# EAGLE design 16ChFNIRS (EAGLE 9.6.2)
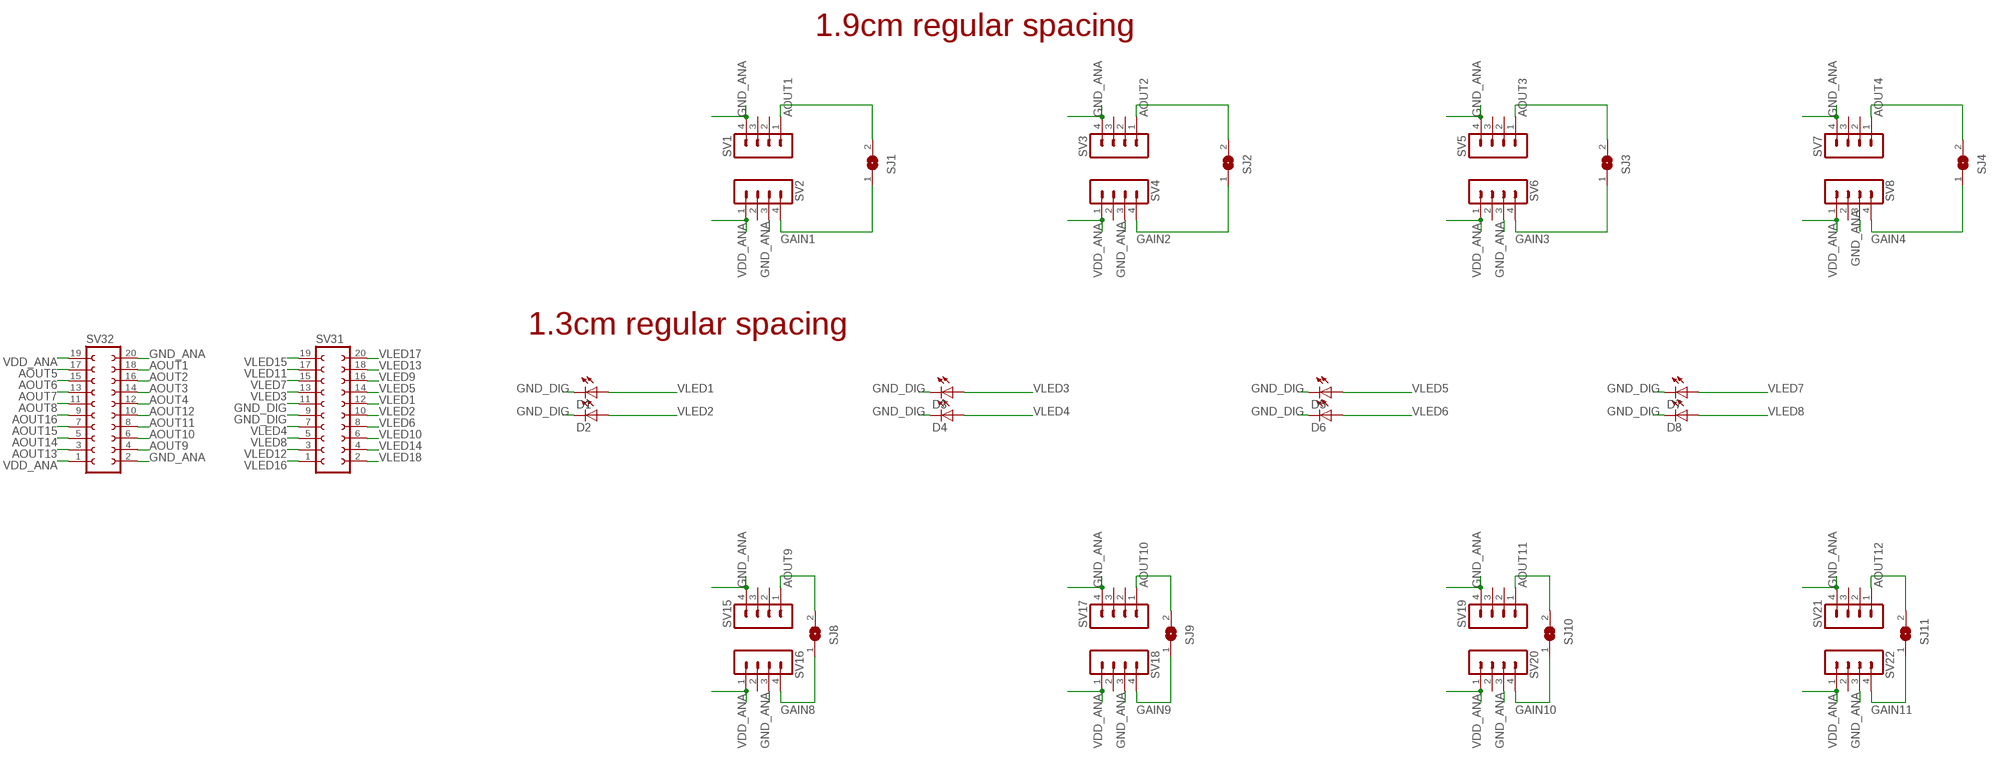
[diagram p0: schematic, sheet 1, part 1 of 2]
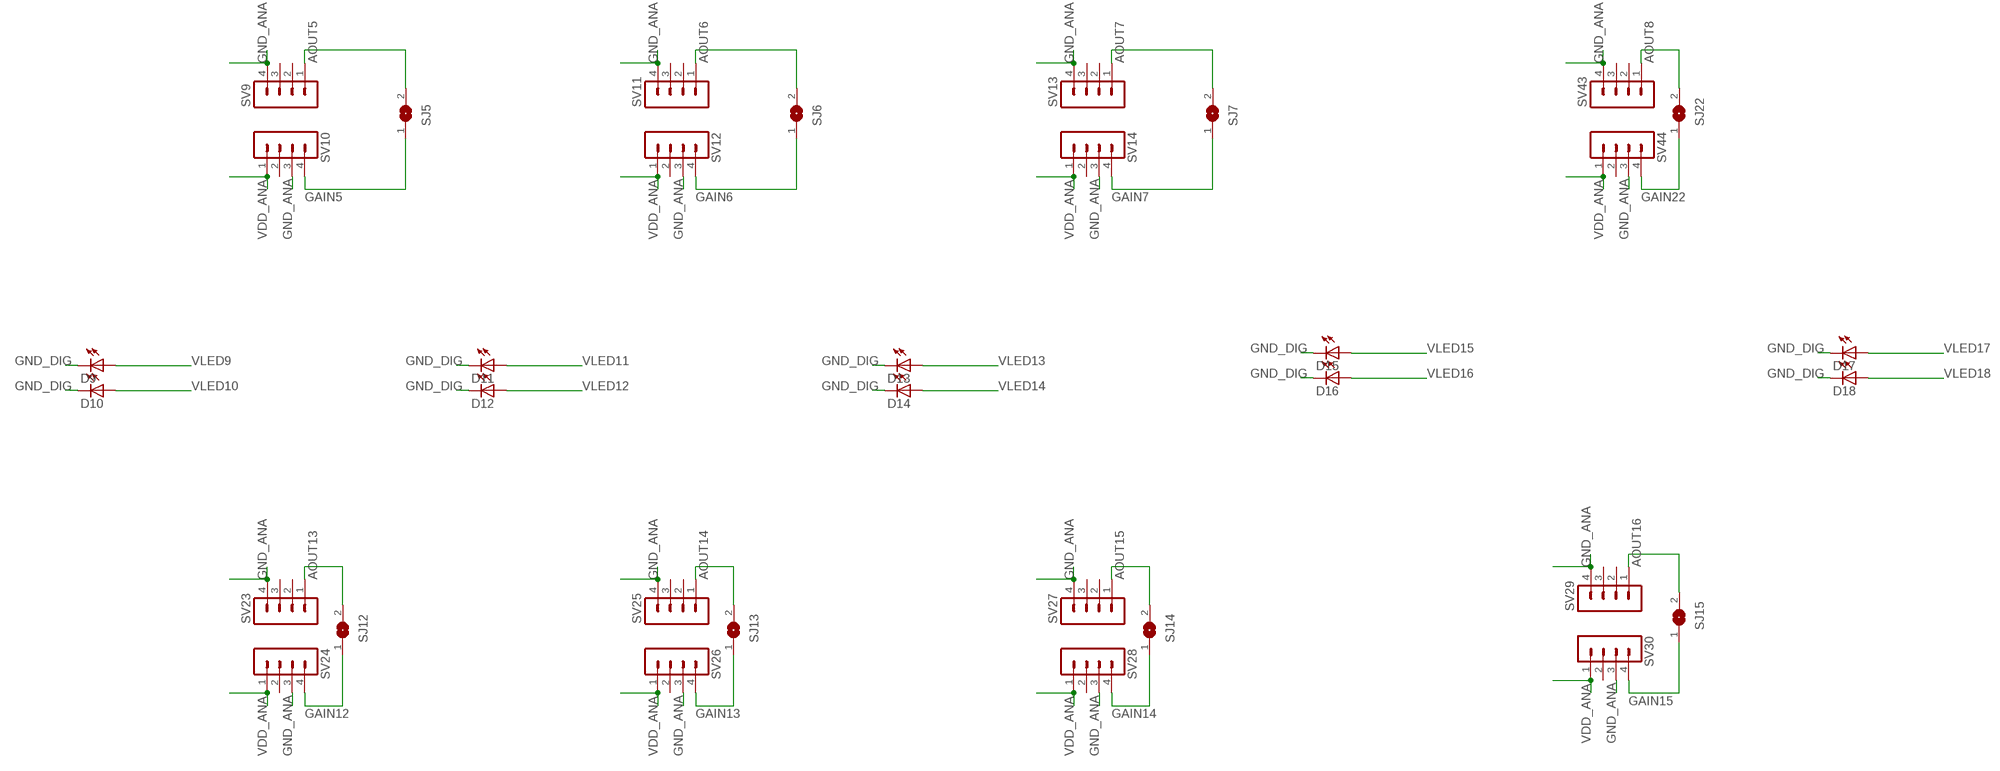
[diagram p1: schematic, sheet 1, part 2 of 2]

## Parts
D1  LED1206  [LED-1206]
D2  LED1206  [LED-1206]
D3  LED1206  [LED-1206]
D4  LED1206  [LED-1206]
D5  LED1206  [LED-1206]
D6  LED1206  [LED-1206]
D7  LED1206  [LED-1206]
D8  LED1206  [LED-1206]
D9  LED1206  [LED-1206]
D10  LED1206  [LED-1206]
D11  LED1206  [LED-1206]
D12  LED1206  [LED-1206]
D13  LED1206  [LED-1206]
D14  LED1206  [LED-1206]
D15  LED1206  [LED-1206]
D16  LED1206  [LED-1206]
D17  LED1206  [LED-1206]
D18  LED1206  [LED-1206]
SJ1  SJ  [SJ]
SJ2  SJ  [SJ]
SJ3  SJ  [SJ]
SJ4  SJ  [SJ]
SJ5  SJ  [SJ]
SJ6  SJ  [SJ]
SJ7  SJ  [SJ]
SJ8  SJ  [SJ]
SJ9  SJ  [SJ]
SJ10  SJ  [SJ]
SJ11  SJ  [SJ]
SJ12  SJ  [SJ]
SJ13  SJ  [SJ]
SJ14  SJ  [SJ]
SJ15  SJ  [SJ]
SJ22  SJ  [SJ]
SV1  MA04-1  [MA04-1]
SV2  MA04-1  [MA04-1]
SV3  MA04-1  [MA04-1]
SV4  MA04-1  [MA04-1]
SV5  MA04-1  [MA04-1]
SV6  MA04-1  [MA04-1]
SV7  MA04-1  [MA04-1]
SV8  MA04-1  [MA04-1]
SV9  MA04-1  [MA04-1]
SV10  MA04-1  [MA04-1]
SV11  MA04-1  [MA04-1]
SV12  MA04-1  [MA04-1]
SV13  MA04-1  [MA04-1]
SV14  MA04-1  [MA04-1]
SV15  MA04-1  [MA04-1]
SV16  MA04-1  [MA04-1]
SV17  MA04-1  [MA04-1]
SV18  MA04-1  [MA04-1]
SV19  MA04-1  [MA04-1]
SV20  MA04-1  [MA04-1]
SV21  MA04-1  [MA04-1]
SV22  MA04-1  [MA04-1]
SV23  MA04-1  [MA04-1]
SV24  MA04-1  [MA04-1]
SV25  MA04-1  [MA04-1]
SV26  MA04-1  [MA04-1]
SV27  MA04-1  [MA04-1]
SV28  MA04-1  [MA04-1]
SV29  MA04-1  [MA04-1]
SV30  MA04-1  [MA04-1]
SV31  FE10-2  [FE10-2]
SV32  FE10-2  [FE10-2]
SV43  MA04-1  [MA04-1]
SV44  MA04-1  [MA04-1]

## Nets
AOUT1: SJ1.2 SV1.1 SV32.18
AOUT2: SJ2.2 SV3.1 SV32.16
AOUT3: SJ3.2 SV5.1 SV32.14
AOUT4: SJ4.2 SV7.1 SV32.12
AOUT5: SJ5.2 SV9.1 SV32.17
AOUT6: SJ6.2 SV11.1 SV32.15
AOUT7: SJ7.2 SV13.1 SV32.13
AOUT8: SJ22.2 SV32.11 SV43.1
AOUT9: SJ8.2 SV15.1 SV32.4
AOUT10: SJ9.2 SV17.1 SV32.6
AOUT11: SJ10.2 SV19.1 SV32.8
AOUT12: SJ11.2 SV21.1 SV32.10
AOUT13: SJ12.2 SV23.1 SV32.3
AOUT14: SJ13.2 SV25.1 SV32.5
AOUT15: SJ14.2 SV27.1 SV32.7
AOUT16: SJ15.2 SV29.1 SV32.9
GAIN1: SJ1.1 SV2.4
GAIN2: SJ2.1 SV4.4
GAIN3: SJ3.1 SV6.4
GAIN4: SJ4.1 SV8.4
GAIN5: SJ5.1 SV10.4
GAIN6: SJ6.1 SV12.4
GAIN7: SJ7.1 SV14.4
GAIN8: SJ8.1 SV16.4
GAIN9: SJ9.1 SV18.4
GAIN10: SJ10.1 SV20.4
GAIN11: SJ11.1 SV22.4
GAIN12: SJ12.1 SV24.4
GAIN13: SJ13.1 SV26.4
GAIN14: SJ14.1 SV28.4
GAIN15: SJ15.1 SV30.4
GAIN22: SJ22.1 SV44.4
GND_ANA: SV1.4 SV2.3 SV3.4 SV4.3 SV5.4 SV6.3 SV7.4 SV8.3 SV9.4 SV10.3 SV11.4 SV12.3 SV13.4 SV14.3 SV15.4 SV16.3 SV17.4 SV18.3 SV19.4 SV20.3 SV21.4 SV22.3 SV23.4 SV24.3 SV25.4 SV26.3 SV27.4 SV28.3 SV29.4 SV30.3 SV32.2 SV32.20 SV43.4 SV44.3
GND_DIG: D1.C D2.C D3.C D4.C D5.C D6.C D7.C D8.C D9.C D10.C D11.C D12.C D13.C D14.C D15.C D16.C D17.C D18.C SV31.9 SV31.11
VDD_ANA: SV2.1 SV4.1 SV6.1 SV8.1 SV10.1 SV12.1 SV14.1 SV16.1 SV18.1 SV20.1 SV22.1 SV24.1 SV26.1 SV28.1 SV30.1 SV32.1 SV32.19 SV44.1
VLED1: D1.A SV31.12
VLED2: D2.A SV31.10
VLED3: D3.A SV31.13
VLED4: D4.A SV31.7
VLED5: D5.A SV31.14
VLED6: D6.A SV31.8
VLED7: D7.A SV31.15
VLED8: D8.A SV31.5
VLED9: D9.A SV31.16
VLED10: D10.A SV31.6
VLED11: D11.A SV31.17
VLED12: D12.A SV31.3
VLED13: D13.A SV31.18
VLED14: D14.A SV31.4
VLED15: D15.A SV31.19
VLED16: D16.A SV31.1
VLED17: D17.A SV31.20
VLED18: D18.A SV31.2
Unconnected: SV1.2 SV1.3 SV2.2 SV3.2 SV3.3 SV4.2 SV5.2 SV5.3 SV6.2 SV7.2 SV7.3 SV8.2 SV9.2 SV9.3 SV10.2 SV11.2 SV11.3 SV12.2 SV13.2 SV13.3 SV14.2 SV15.2 SV15.3 SV16.2 SV17.2 SV17.3 SV18.2 SV19.2 SV19.3 SV20.2 SV21.2 SV21.3 SV22.2 SV23.2 SV23.3 SV24.2 SV25.2 SV25.3 SV26.2 SV27.2 SV27.3 SV28.2 SV29.2 SV29.3 SV30.2 SV43.2 SV43.3 SV44.2

## Notes on the sheet
- 1.9cm regular spacing
- 1.3cm regular spacing

## Library data of the parts
D1-D18 = epic:LED: LEDs Standard schematic elements and footprints for 5mm, 3mm, 1206, and 0603 sized LEDs. 5mm - Spark Fun Electronics SKU : COM-00529 (and others)
SJ1-SJ15 SJ22 = jumper:SJ: SMD solder JUMPER
SV1-SV30 SV43 SV44 = con-lstb:MA04-1: PIN HEADER; OC_FARNELL: unknown; OC_NEWARK: unknown
SV31 SV32 = con-lsta:FE10-2: FEMALE HEADER; OC_FARNELL: unknown; OC_NEWARK: unknown

## Board
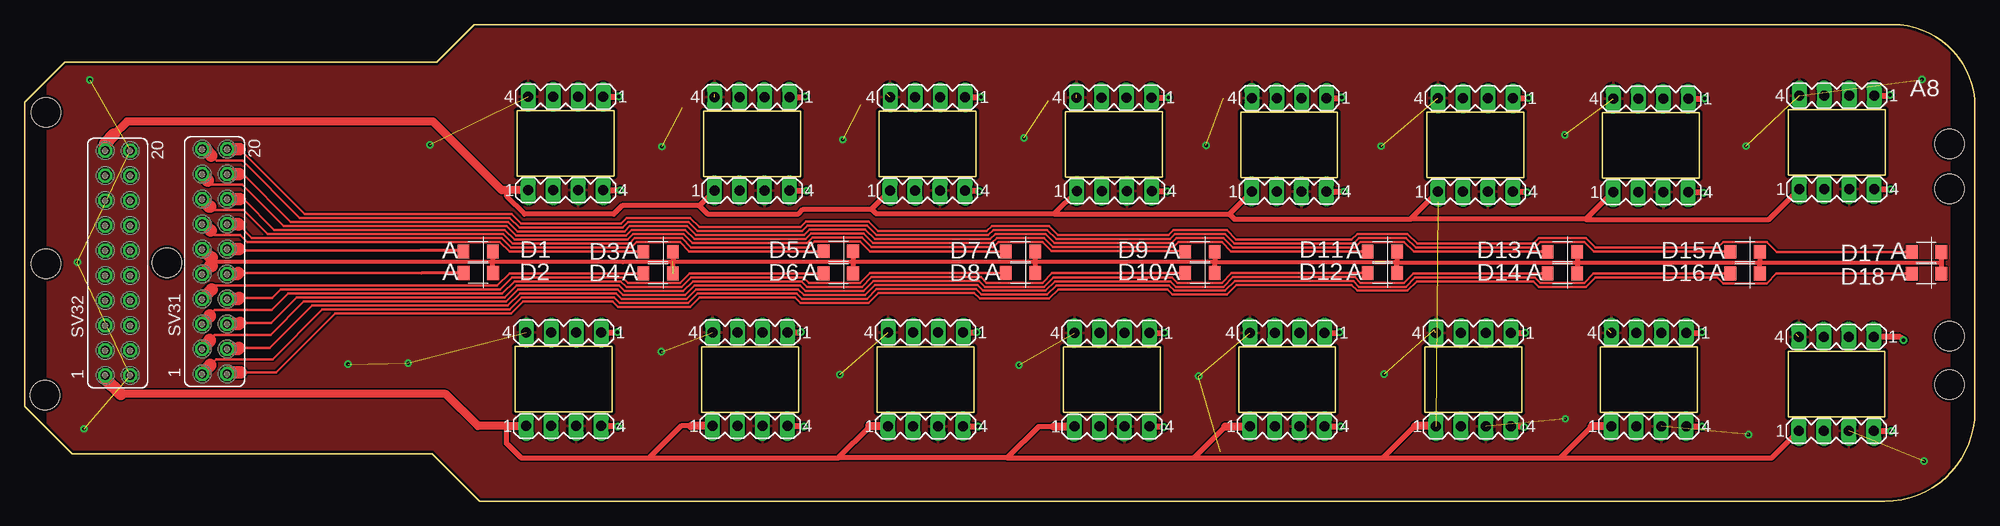
[diagram p2: board, top side]
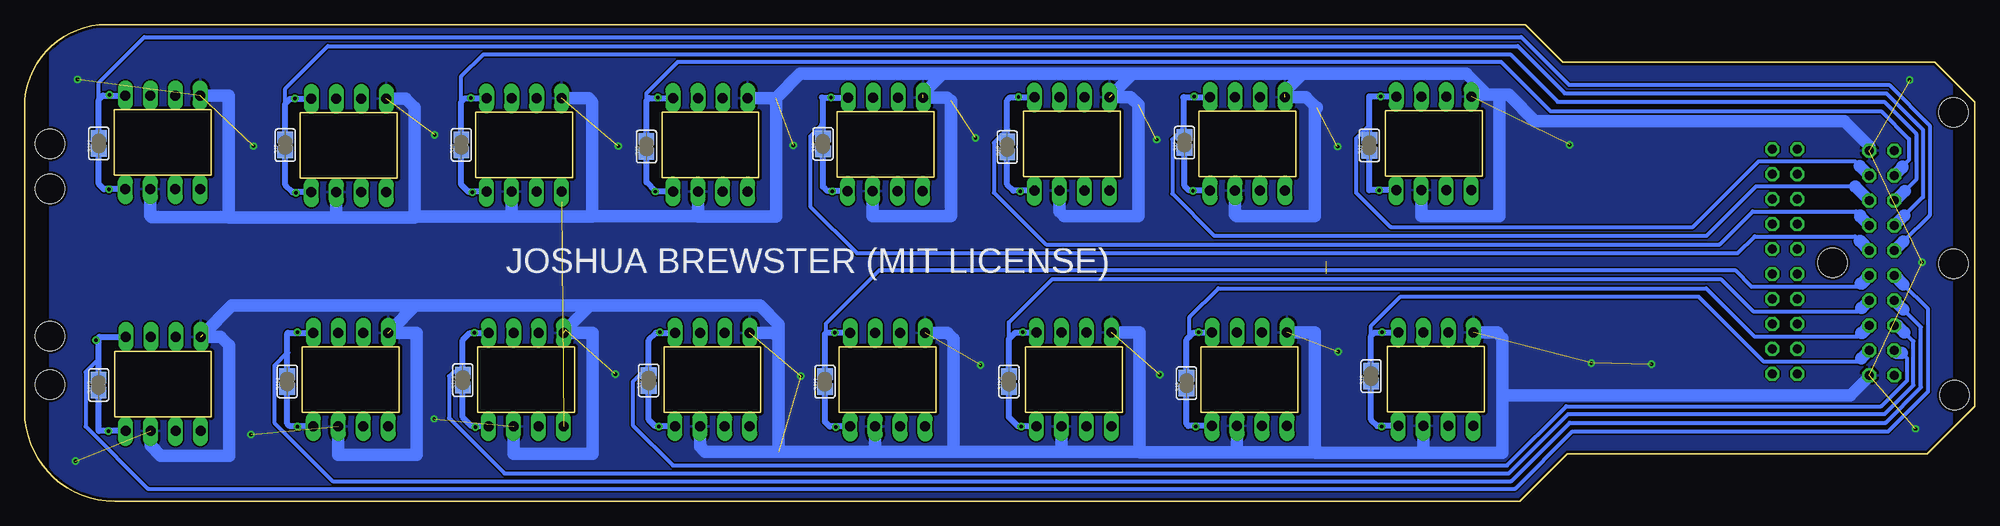
[diagram p3: board, bottom side, seen from below]

Size 198.37 x 48.51 mm. Coordinates in mm from the lower left corner, seen from the top.
Outline: 78.91,33.05 69.07,33.05 69.07,39.71 78.91,39.71 78.91,33.05
Outline: 59.96,33.07 50.12,33.07 50.12,39.74 59.96,39.74 59.96,33.07
Outline: 115.72,32.99 105.87,32.99 105.87,39.66 115.72,39.66 115.72,32.99
Outline: 96.77,33.02 86.93,33.02 86.93,39.69 96.77,39.69 96.77,33.02
Outline: 152.5,32.92 142.65,32.92 142.65,39.59 152.5,39.59 152.5,32.92
Outline: 133.55,32.94 123.7,32.94 123.7,39.61 133.55,39.61 133.55,32.94
Outline: 170.33,32.87 160.48,32.87 160.48,39.53 170.33,39.53 170.33,32.87
Outline: 49.92,15.75 59.76,15.75 59.76,9.08 49.92,9.08 49.92,15.75
Outline: 68.87,15.72 78.71,15.72 78.71,9.05 68.87,9.05 68.87,15.72
Outline: 86.72,15.72 96.56,15.72 96.56,9.05 86.72,9.05 86.72,15.72
Outline: 105.67,15.7 115.51,15.7 115.51,9.03 105.67,9.03 105.67,15.7
Outline: 123.5,15.72 133.34,15.72 133.34,9.05 123.5,9.05 123.5,15.72
Outline: 142.45,15.7 152.29,15.7 152.29,9.03 142.45,9.03 142.45,15.7
Outline: 160.28,15.72 170.12,15.72 170.12,9.05 160.28,9.05 160.28,15.72
Outline: 189.21,8.58 179.37,8.58 179.37,15.25 189.21,15.25 189.21,8.58
Outline: 179.4,39.87 189.24,39.87 189.24,33.2 179.4,33.2 179.4,39.87
Outline: 41.91,44.7 4.06,44.7 0,40.64 0,9.65 4.83,4.83 41.45,4.83 46.28,0 189.23,0 arc90 198.37,9.14 198.37,40.13 arc90 189.99,48.51 45.72,48.51 41.91,44.7
Copper layers (1*16): Top 0.035mm / dielectric 1.5mm / Bottom 0.035mm
Design rules "default *": minimum track width 6mil, minimum drill 0.35mm, track to track 6mil, track to pad 6mil, pad to pad 6mil, via to via 6mil, smd to smd 6mil, copper to edge 10mil, drill to drill 6mil, minimum pad ring 10mil, minimum via ring 8mil, stop-mask expansion 4mil, vias tented up to drill 0mil, thermal gap 10mil
Holes 3 mm at 2.17,39.58 14.47,24.28 2.17,24.18 2.07,10.78 195.77,36.38 195.77,31.78 195.77,16.78 195.77,11.88

### Footprints (pad centres in the part's own frame; a part is rotated, then mirrored left to right if it is on the bottom)
LED-1206 = smd 1.2 x 1.4: A -1.5,0; C 1.5,0
SJ = smd 1.168 x 1.6: 1 -0.762,0; 2 0.762,0
MA04-1 = drill 1.016 long: 1 -3.81,0; 2 -1.27,0; 3 1.27,0; 4 3.81,0
FE10-2 = drill 0.914 octagon: 1 -11.43,1.27; 2 -11.43,-1.27; 3 -8.89,1.27; 4 -8.89,-1.27; 5 -6.35,1.27; 6 -6.35,-1.27; 7 -3.81,1.27; 8 -3.81,-1.27; 9 -1.27,1.27; 10 -1.27,-1.27; 11 1.27,1.27; 12 1.27,-1.27; 13 3.81,1.27; 14 3.81,-1.27; 15 6.35,1.27; 16 6.35,-1.27; 17 8.89,1.27; 18 8.89,-1.27; 19 11.43,1.27; 20 11.43,-1.27

### Placement (x,y rotation side)
D1  46.13,25.43 0 top
D2  46.15,23.22 0 top
D3  64.44,25.4 0 top
D4  64.44,23.19 0 top
D5  82.78,25.45 0 top
D6  82.78,23.19 0 top
D7  101.3,25.43 0 top
D8  101.3,23.22 0 top
D9  119.56,25.4 0 top
D10  119.56,23.22 0 top
D11  138.1,25.43 0 top
D12  138.1,23.22 0 top
D13  156.41,25.4 0 top
D14  156.41,23.19 0 top
D15  174.98,25.4 0 top
D16  174.98,23.16 0 top
D17  193.44,25.37 0 top
D18  193.44,23.16 0 top
SJ1  61.59,36.22 90 bottom
SJ2  80.39,36.5 90 bottom
SJ3  98.42,36.04 90 bottom
SJ4  117.17,36.37 90 bottom
SJ5  135.13,36.09 90 bottom
SJ6  153.95,36.27 90 bottom
SJ7  171.86,36.25 90 bottom
SJ8  61.42,12.73 90 bottom
SJ9  80.19,12.01 90 bottom
SJ10  98.25,12.19 90 bottom
SJ11  116.97,12.17 90 bottom
SJ12  134.9,12.29 90 bottom
SJ13  153.8,12.32 90 bottom
SJ14  171.65,12.19 90 bottom
SJ15  190.85,11.83 90 bottom
SJ22  190.83,36.41 90 bottom
SV1  55.04,41.17 180 top
SV2  55.04,31.65 0 top
SV3  73.99,41.15 180 top
SV4  73.99,31.62 0 top
SV5  91.85,41.12 180 top
SV6  91.85,31.6 0 top
SV7  110.79,41.1 180 top
SV8  110.85,31.57 0 top
SV9  128.63,41.05 180 top
SV10  128.63,31.52 0 top
SV11  147.57,41.02 180 top
SV12  147.57,31.5 0 top
SV13  165.4,40.97 180 top
SV14  165.4,31.45 0 top
SV15  54.84,17.17 180 top
SV16  54.84,7.65 0 top
SV17  73.79,17.17 180 top
SV18  73.79,7.65 0 top
SV19  91.64,17.17 180 top
SV20  91.64,7.62 0 top
SV21  110.59,17.12 180 top
SV22  110.59,7.59 0 top
SV23  128.42,17.14 180 top
SV24  128.42,7.62 0 top
SV25  147.37,17.12 180 top
SV26  147.37,7.62 0 top
SV27  165.2,17.14 180 top
SV28  165.2,7.62 0 top
SV29  184.27,16.74 180 top
SV30  184.29,7.16 0 top
SV31  19.32,24.39 90 top
SV32  9.46,24.24 90 top
SV43  184.32,41.29 180 top
SV44  184.32,31.77 0 top

### Tracks (layer width: path | path; a pad name or v marks a point on that pad's centre or on a via)
AOUT1  (via drill 0.35)
  Top 0.61: SV1.1 60.43,41.17 v60.43,41.21
  Bottom 0.406: 61.59,38.26 62.95,36.91 62.95,31.41 59.44,27.91 28.68,27.91 21.99,34.59 12.21,34.59 11.73,34.12
  Bottom 0.61: SJ1.2 61.59,38.26 61.59,41.18 61.6,41.17 SV1.1
  Bottom 1.27: SV32.18 11.72,34.12 11.73,34.12
AOUT2  (via drill 0.35)
  Top 0.61: SV3.1 79.4,41.15 v79.4,41.18
  Bottom 0.406: 80.52,37.94 81.65,36.81 81.65,31.3 77.38,27.03 27.29,27.03 22.27,32.05 12.19,32.05
  Bottom 0.61: SJ2.2 80.52,37.03 80.52,37.94 80.52,41.12 80.49,41.15 SV3.1
  Bottom 1.27: SV32.16 12.19,32.04 12.19,32.05
AOUT3  (via drill 0.35)
  Top 0.61: SV5.1 97.28,41.12 v97.28,41.16
  Bottom 0.406: 98.42,37.83 99.77,36.48 99.77,31.4 94.51,26.13 25.97,26.13 22.6,29.5 12.08,29.5 11.64,29.06
  Bottom 0.61: SJ3.2 98.42,37.83 98.42,40.82 98.12,41.12 SV5.1
  Bottom 1.27: SV32.14 11.64,28.95 11.64,29.06
AOUT4  (via drill 0.35)
  Top 0.61: SV7.1 116.35,41.1 v116.35,41.11
  Bottom 0.406: 117.22,38.37 118.46,37.13 118.46,29.99 113.7,25.24 24.12,25.24 22.4,26.96 12.2,26.96 11.7,26.46
  Bottom 0.61: SJ4.2 117.22,36.82 117.22,38.37 117.22,41.12 117.25,41.1 | 117.27,41.1 117.25,41.1 | 117.25,41.1 SV7.1
  Bottom 1.27: SV32.12 11.68,26.46 11.7,26.46
AOUT5  (via drill 0.35)
  Top 0.61: SV9.1 133.99,41.05 v133.99,41.08
  Bottom 0.406: 135.13,40.77 135.13,41.53 131.93,44.73 48.19,44.73 43.16,39.7 9.55,39.7 6.7,36.85 6.7,34.73 7.37,34.06
  Bottom 0.61: SJ5.2 135.13,40.77 134.85,41.05 SV9.1
  Bottom 1.27: SV32.17 7.37,33.95 7.37,34.06
AOUT6  (via drill 0.35)
  Top 0.61: SV11.1 152.98,41.02 v152.98,41.06
  Bottom 0.406: 153.95,40.66 153.95,43.24 151.71,45.48 47.25,45.48 42.43,40.66 9.22,40.66 5.97,37.4 5.97,32.72 7.13,31.55
  Bottom 0.61: SJ6.2 153.95,40.66 153.59,41.02 SV11.1
  Bottom 1.27: 7.13,31.55 8.1,30.59 SV32.15
AOUT7  (via drill 0.35)
  Top 0.61: SV13.1 170.89,40.97 v170.89,41
  Bottom 0.406: 171.86,40.49 171.86,41.99 167.53,46.32 46.51,46.32 41.71,41.53 9.01,41.53 5.29,37.82 5.29,30.95 7.19,29.06
  Bottom 0.61: SJ7.2 171.86,40.49 171.37,40.97 SV13.1
  Bottom 1.27: 7.19,29.06 8.19,28.05 SV32.13
AOUT8  (via drill 0.35)
  Top 0.61: SV43.1 189.73,41.29 v189.73,41.34
  Bottom 0.406: 190.82,40.88 190.82,42.61 186.19,47.25 46.15,47.25 41.29,42.38 8.73,42.38 4.6,38.25 4.6,29.09 7.27,26.42
  Bottom 0.61: SJ22.2 190.82,40.88 190.42,41.29 SV43.1
  Bottom 1.27: 7.27,26.42 SV32.11
AOUT9  (via drill 0.35)
  Top 0.61: SV15.1 60.27,17.17 v60.27,17.22
  Bottom 0.406: 61.42,16.84 61.42,17.85 58.44,20.83 28.11,20.83 21.53,14.25 11.87,14.25 11.58,14.54
  Bottom 0.61: SJ8.2 61.42,16.84 61.09,17.17 SV15.1
  Bottom 1.27: SV32.4 11.54,14.54 11.58,14.54
AOUT10  (via drill 0.35)
  Top 0.61: SV17.1 78.94,17.17 v78.94,17.19
  Bottom 0.406: 79.88,16.77 79.88,18.75 76.96,21.67 27.33,21.67 22.45,16.79 11.91,16.79 11.56,17.14
  Bottom 0.61: SJ9.2 80.19,16.46 79.88,16.77 79.48,17.17 SV17.1
  Bottom 1.27: SV32.6 11.48,17.14 11.56,17.14
AOUT11  (via drill 0.35)
  Top 0.61: SV19.1 96.85,17.17 v96.85,17.19
  Bottom 0.406: 98.25,16.51 98.25,18.2 93.83,22.62 25.85,22.62 22.55,19.32 11.9,19.32 11.54,19.67
  Bottom 0.61: SJ10.2 98.25,16.51 97.59,17.17 SV19.1
  Bottom 1.27: SV32.8 11.48,19.67 11.54,19.67
AOUT12  (via drill 0.35)
  Top 0.61: SV21.1 115.95,17.12 v115.95,17.17
  Bottom 0.406: 116.86,17.12 116.86,18.08 111.42,23.52 24.39,23.52 22.72,21.85 11.97,21.85 11.63,22.18
  Bottom 0.61: SJ11.2 116.97,17.02 116.86,17.12 SV21.1
  Bottom 1.27: SV32.10 11.52,22.18 11.63,22.18
AOUT13  (via drill 0.35)
  Top 0.61: SV23.1 133.76,17.14 v133.76,17.19
  Bottom 0.406: 134.9,13.77 136.51,12.16 136.51,7.73 132.42,3.63 47.59,3.63 41.57,9.65 9.53,9.65 6.89,12.3 6.89,14.53 7.44,15.08
  Bottom 0.61: SJ12.2 134.9,13.77 134.9,16.41 134.16,17.14 SV23.1
  Bottom 1.27: SV32.3 7.93,15.08 7.44,15.08
AOUT14  (via drill 0.35)
  Top 0.61: SV25.1 152.63,17.12 v152.63,17.17
  Bottom 0.406: 153.8,13.18 154.72,13.18 155.2,12.71 155.2,8.46 149.57,2.83 47.41,2.83 41.36,8.88 9.19,8.88 6.26,11.81 6.26,16.27 7.17,17.18
  Bottom 0.61: SJ13.2 153.8,13.18 153.8,16.41 153.09,17.12 SV25.1
  Bottom 1.27: 7.17,17.18 7.88,17.89 SV32.5
AOUT15  (via drill 0.35)
  Top 0.61: SV27.1 170.61,17.14 v170.61,17.19
  Bottom 0.406: 171.65,15.12 172.98,13.79 172.98,7.98 167.04,2.04 47.16,2.04 41.21,8 9.08,8 5.49,11.59 5.49,17.72 7.27,19.49
  Bottom 0.61: SJ14.2 171.65,15.12 171.65,17.09 171.6,17.14 SV27.1
  Bottom 1.27: 7.27,19.49 SV32.7
AOUT16  (via drill 0.35)
  Top 0.61: SV29.1 188.1,16.71 190.77,16.71 v191.1,16.38
  Bottom 0.406: 190.85,14.48 192.18,13.15 192.18,7.61 185.85,1.28 46.77,1.28 40.94,7.11 8.82,7.11 4.77,11.16 4.77,19.56 7.29,22.08
  Bottom 0.61: SJ15.2 190.85,14.48 190.85,16.63 | 190.85,16.63 190.74,16.74 SV29.1 | 190.85,16.63 v191.1,16.38
  Bottom 1.27: 7.29,22.08 8.18,22.97 SV32.9
GAIN1  (via drill 0.35)
  Top 0.61: SV2.4 v60.61,31.65 v60.61,31.64
  Bottom 0.61: SV2.4 61.59,31.65 SJ1.1
GAIN2  (via drill 0.35)
  Top 0.61: SV4.4 79.53,31.62 v79.53,31.59
  Bottom 0.61: SV4.4 79.93,31.62 80.39,32.08 SJ2.1
GAIN3  (via drill 0.35)
  Top 0.61: SV6.4 97.1,31.6 v97.1,31.55
  Bottom 0.61: SV6.4 97.79,31.6 98.42,32.23 SJ3.1
GAIN4  (via drill 0.35)
  Top 0.61: SV8.4 116.23,31.57 v116.23,31.52
  Bottom 0.61: SV8.4 116.74,31.57 117.17,32 SJ4.1
GAIN5  (via drill 0.35)
  Top 0.61: SV10.4 v134.2,31.52 v134.2,31.51
  Bottom 0.61: SV10.4 134.19,31.52 135.13,32.46 SJ5.1
GAIN6  (via drill 0.35)
  Top 0.61: SV12.4 152.81,31.5 v152.81,31.45
  Bottom 0.61: SV12.4 153.24,31.5 153.95,32.21 SJ6.1
GAIN7  (via drill 0.35)
  Top 0.61: SV14.4 170.76,31.45 v170.76,31.4
  Bottom 0.61: SV14.4 171.12,31.45 171.86,32.18 SJ7.1
GAIN8  (via drill 0.35)
  Top 0.61: SV16.4 60.35,7.64 v60.35,7.61
  Bottom 0.61: SV16.4 60.78,7.64 61.42,8.28 SJ8.1
GAIN9  (via drill 0.35)
  Top 0.61: SV18.4 79.25,7.64 v79.25,7.58
  Bottom 0.61: SV18.4 80.01,7.64 80.19,7.82 SJ9.1
GAIN10  (via drill 0.35)
  Top 0.61: SV20.4 97,7.62 v97,7.58
  Bottom 0.61: SV20.4 97.33,7.62 98.25,8.53 SJ10.1
GAIN11  (via drill 0.35)
  Top 0.61: SV22.4 115.88,7.59 v115.88,7.56
  Bottom 0.61: SV22.4 116.48,7.59 116.97,8.08 SJ11.1
GAIN12  (via drill 0.35)
  Top 0.61: SV24.4 133.88,7.62 v133.88,7.58
  Bottom 0.61: SV24.4 134.24,7.62 134.9,8.28 SJ12.1
GAIN13  (via drill 0.35)
  Top 0.61: SV26.4 152.53,7.62 v152.53,7.56
  Bottom 0.61: SV26.4 152.88,7.62 153.8,8.53 SJ13.1
GAIN14  (via drill 0.35)
  Top 0.61: SV28.4 170.61,7.62 v170.61,7.58
  Bottom 0.61: SV28.4 171.4,7.62 171.65,7.87 SJ14.1
GAIN15  (via drill 0.35)
  Top 0.61: SV30.4 189.85,7.16 v189.85,7.14
  Bottom 0.61: SV30.4 190.8,7.16 190.85,7.21 SJ15.1
GAIN22  (via drill 0.35)
  Top 0.61: SV44.4 189.78,31.77 v189.78,31.73
  Bottom 0.61: SV44.4 190.32,31.77 190.82,32.27 SJ22.1
GND_ANA  (via drill 0.35)  (30 unrouted)
  Bottom 1.27: SV1.4 51.04,41.36 49.59,41.36 | 49.59,41.36 48.35,41.36 | SV15.4 48.57,17.17 48.62,17.12 48.05,16.55 48.05,10.78 | 67.11,40.21 67.11,29.02 75.13,29.02 75.26,29.16 SV4.3 | 67.11,5 67.11,17.17 SV17.4 | SV3.4 68.05,41.15 67.11,40.21 | 67.11,40.21 66.95,40.05 | 84.97,5.01 84.97,17.17 SV19.4 | SV5.4 85.88,41.12 85.1,40.34 | 85.1,40.34 | SV7.4 104.57,41.1 104.19,40.72 | 104.19,40.72 104.14,40.66 104.14,29.01 112.12,29.01 SV8.3 | SV21.4 104.52,17.12 103.91,16.5 103.91,5.01 | 121.94,41.05 121.94,28.96 129.85,28.96 129.9,29.01 | SV9.4 121.94,41.05 | 121.94,41.05 121.92,41.05 | SV23.4 122.17,17.14 121.68,16.65 | 140.64,28.96 140.64,40.64 141.02,41.02 SV11.4 | SV25.4 140.62,17.12 140.62,4.81 148.64,4.81 SV26.3 | 158.68,28.87 158.68,40.03 159.61,40.97 SV13.4 | SV27.4 158.49,17.14 158.49,4.74 166.47,4.74 SV28.3 | 85.1,40.34 85.1,29.01 92.66,29.01 93.12,29.46 SV6.3 | 104.14,40.77 104.19,40.72 | SV2.3 56.31,29.01 48.35,29.01 48.35,41.36 | SV14.3 166.68,28.87 | 158.68,28.87 166.68,28.87 | SV12.3 148.84,28.96 | 140.64,28.96 148.84,28.96 | SV10.3 129.9,29.01 | SV18.3 75.06,5 | SV20.3 92.91,5.01 | SV43.4 177.62,41.29 177.62,28.94 | SV44.3 185.59,29.09 185.44,28.94 177.62,28.94 | SV30.3 185.56,5.68 184.53,4.64 179.32,4.64 179.34,4.62 177.56,4.62 177.56,15.84 178.45,16.74 SV29.4 | 121.61,5.04 129.17,5.04 129.69,5.56 SV24.3 | 92.91,5.01 84.97,5.01 | 55.85,4.9 48.05,4.9 48.05,10.78 | 55.85,4.9 56.11,5.16 SV16.3 | 121.68,16.65 121.68,5.01 111.86,5.01 | SV22.3 111.86,5.01 | 75.06,5 67.11,5 | 103.91,5.01 92.91,5.01 | 84.97,5.01 84.95,5 75.06,5 | 67.11,5 67.01,4.9 55.85,4.9 | 111.86,5.01 103.91,5.01 | 121.68,16.65 121.68,18.01 123.58,19.91 140.86,19.91
  Bottom 1.27: 140.86,19.91 158.63,19.91 | 158.63,19.91 177.29,19.91 180.22,16.98 | 158.63,19.91 161.09,17.45 | 140.86,19.91 143.34,17.42 | 49.59,41.36 51.73,43.51 68.35,43.51 | 68.35,43.51 85.63,43.51 | 85.63,43.51 104.94,43.51 | 104.94,43.51 119.48,43.51 121.94,41.05 | 104.94,43.51 106.98,41.46 106.98,41.39 | 85.63,43.51 87.73,41.41 | 68.35,43.51 70.18,41.68 70.18,41.44 | 129.9,29.01 140.59,29.01 140.64,28.96 | 148.84,28.96 158.58,28.96 158.68,28.87 | 166.68,28.87 177.55,28.87 177.62,28.94 | 48.35,41.36 47.42,41.36 44.77,38.71 13.31,38.71 10.73,36.13 SV32.20 | 48.05,10.78 12.66,10.78 10.73,12.71 SV32.2
  other vias: 5.36,24.31 192.99,42.93 175.08,36.14 156.67,37.29 138,36.14 120.17,36.22 101.65,36.98 83.24,36.8 64.82,36.09 41.22,36.27 32.89,13.94 39.01,14.07 64.77,15.21 82.93,12.9 101.14,13.87 119.41,12.73 138.3,12.95 156.72,8.38 175.34,6.78 193.22,4.06 6.63,42.88 6.05,7.37
  pour Bottom: 2.29,4.57 2.29,44.7 41.91,44.7 41.91,48.77 195.83,48.77 195.83,-0.25 41.43,-0.25 41.43,4.57
  pour Top: 2.29,44.7 41.91,44.7 41.91,48.77 195.83,48.77 195.83,-0.25 41.43,-0.25 41.43,4.57 2.29,4.57
GND_DIG  (1 unrouted)
  Top 0.406: 60.85,24.34 65.94,24.34 84.25,24.34 84.28,24.37 84.31,24.34 102.8,24.34 120.95,24.34 121.06,24.24 121.1,24.29 139.6,24.29 139.63,24.25 157.91,24.25 176.46,24.25 176.48,24.23 194.95,24.23 | 60.85,24.34 | 60.85,24.34 47.63,24.34 47.62,24.35 19.45,24.35 19.45,24.36 | 19.02,24.78 19.45,24.36 | 19.45,24.36 19.03,23.94 19.01,23.94
  Top 0.508: D1.C 47.63,24.34 47.63,23.24 D2.C | D17.C 194.95,25.36 194.95,24.23 194.95,23.16 D18.C | D3.C 65.94,24.41 | D4.C 65.94,24.34 | D5.C 84.28,24.37 D6.C | D7.C 102.8,24.34 D8.C | D9.C 121.06,24.24 D10.C | D11.C 139.6,24.29 D12.C | D13.C 157.91,24.25 D14.C | D15.C 176.48,24.23 D16.C
  Top 1.27: SV31.11 18.93,24.78 19.02,24.78 | SV31.9 18.88,23.94 19.01,23.94
VDD_ANA  (1 unrouted)
  Top 0.508: 68.61,30.08 60.8,30.08 59.93,29.22 50.85,29.22 49.06,31.01 49.06,31.65 | 51.23,30.76 SV2.1 | 70.18,30.57 SV4.1 68.65,30.1 68.59,30.1 68.61,30.08 | 86.16,29.72 SV6.1 88.04,30.77 | 86.16,29.72 79.19,29.72 78.7,29.23 69.46,29.23 68.61,30.08 | 104.72,29.26 SV8.1 | 104.72,29.26 86.62,29.26 86.16,29.72 | 122.54,29.22 104.76,29.22 104.72,29.26 | SV10.1 122.53,29.23 122.54,29.22 | 140.97,28.7 SV12.1 143.76,30.43 | 140.97,28.7 123.05,28.7 122.54,29.22 | SV14.1 161.56,31.45 158.81,28.7 | 158.81,28.7 158.8,28.69 177.43,28.69 SV44.1 | 158.81,28.7 140.97,28.7 | 67.77,7.64 66.77,7.64 63.52,4.39 | 49.01,7.64 49.01,5.88 50.51,4.39 63.52,4.39 | 63.52,4.39 82.75,4.39 | 82.75,4.39 85.98,7.62 | 104.67,7.57 103.13,7.57 99.95,4.39 | 99.95,4.39 82.75,4.39 | 99.95,4.39 118.93,4.39 | 118.93,4.39 122.14,7.6 | 118.93,4.39 138.16,4.39 | 138.16,4.39 141.43,7.66 | 138.16,4.39 156.2,4.39 | 156.2,4.39 159.43,7.62 | 156.2,4.39 177.71,4.39 SV30.1
  Top 0.813: SV30.1 180.48,7.13 | SV2.1 49.06,31.65 | 49.05,31.65 49.06,31.65 | SV16.1 49.01,7.64 46.11,7.64 42.85,10.9 9.75,10.9 | SV18.1 67.77,7.64 67.77,7.65 | SV20.1 85.98,7.62 85.91,7.68 | SV22.1 106.76,7.57 104.67,7.57 | SV24.1 124.59,7.6 122.14,7.6 | 141.43,7.66 143.52,7.66 SV26.1 | SV28.1 159.43,7.62 159.41,7.6 | SV4.1 69.86,31.62 69.84,31.65 | 49.06,31.65 48.54,31.65 41.55,38.64 10.42,38.64 9.08,37.3
  Top 1.27: SV32.19 8.19,36.41 9.08,37.3 | SV32.1 8.19,12.47 9.75,10.9
VLED1
  Top 0.254: 40.25,25.54 21.94,25.54 21.83,25.64
  Top 0.305: D1.A 44.51,25.54 40.25,25.54
  Top 1.27: SV31.12 21.82,25.66 21.83,25.64
VLED2
  Top 0.254: 40.36,23.21 21.73,23.21 21.73,23.22
  Top 0.305: D2.A 40.36,23.21
  Top 1.27: SV31.10 21.63,23.12 21.73,23.21
VLED3
  Top 0.254: D3.A 49.36,25.39 48.34,26.41 22.63,26.41 21.93,27.1 19.33,27.1 18.94,27.5 18.94,27.55
  Top 0.305: D3.A
  Top 1.27: SV31.13 18.29,28.2 18.94,27.55
VLED4
  Top 0.254: D4.A 49.32,23.19 48.07,21.94 19.4,21.94 19.01,21.55
  Top 1.27: SV31.7 19.01,21.53 19.01,21.55
VLED5
  Top 0.254: 81.27,25.46 81.23,25.43 67.6,25.43 66.66,26.38 62.22,26.38 61.68,25.84 49.49,25.84 48.51,26.81 23.11,26.81 21.78,28.14
  Top 0.305: 81.27,25.46 D5.A
  Top 1.27: SV31.14 21.73,28.2 21.78,28.14
VLED6
  Top 0.254: 81.11,23.19 67.64,23.19 66.66,22.21 61.38,22.21 60.81,22.77 49.61,22.77 48.36,21.53 26.04,21.53 25.18,20.66 21.82,20.66
  Top 0.305: 81.11,23.19 D6.A
  Top 1.27: SV31.8 21.73,20.58 21.82,20.66
VLED7
  Top 0.254: D7.A 86,25.42 84.99,26.43 80.33,26.43 79.75,25.84 67.81,25.84 66.87,26.79 62.06,26.79 61.51,26.24 49.65,26.24 48.68,27.22 24.72,27.22 22.29,29.65 19.26,29.65 18.9,30.01
  Top 1.27: SV31.15 18.78,30.01 18.9,30.01
VLED8
  Top 0.254: D8.A 86,23.22 84.99,22.21 79.77,22.21 79.2,22.78 67.8,22.78 66.82,21.8 61.21,21.8 60.64,22.37 49.84,22.37 48.59,21.12 26.81,21.12 25.12,19.44 19.36,19.44 18.83,18.91
  Top 1.27: SV31.5 18.83,18.81 18.83,18.91
VLED9
  Top 0.254: D9.A 117.99,25.47 104.45,25.47 103.51,26.41 99.08,26.41 98.53,25.86 86.14,25.86 85.16,26.84 80.17,26.84 79.59,26.27 67.96,26.27 67.03,27.19 61.89,27.19 61.34,26.65 49.82,26.65 48.85,27.62 25.41,27.62 22.28,30.75 21.9,30.75
  Top 1.27: SV31.16 21.88,30.74 21.9,30.75
VLED10
  Top 0.254: D10.A 104.49,23.22 103.51,22.24 97.84,22.24 97.27,22.81 86.17,22.81 85.16,21.8 79.6,21.8 79.03,22.38 67.97,22.38 66.99,21.4 61.04,21.4 60.48,21.96 50.06,21.96 48.81,20.72 27.66,20.72 25.09,18.15 21.91,18.15
  Top 1.27: SV31.6 21.8,18.04 21.91,18.15
VLED11
  Top 0.254: D11.A 122.73,25.43 121.77,26.38 117.34,26.38 116.84,25.88 104.61,25.88 103.68,26.81 98.91,26.81 98.36,26.26 86.31,26.26 85.33,27.24 80,27.24 79.43,26.67 68.13,26.67 67.2,27.6 61.72,27.6 61.18,27.05 49.99,27.05 49.02,28.03 26.34,28.03 22.14,32.23 19.04,32.23 18.64,32.63
  Top 1.27: SV31.17 18.64,32.69 18.64,32.63
VLED12
  Top 0.254: D12.A 122.75,23.22 121.77,22.24 117.27,22.24 116.73,22.78 104.63,22.78 103.68,21.83 97.67,21.83 97.1,22.4 86.34,22.4 85.33,21.4 79.43,21.4 78.86,21.97 68.14,21.97 67.16,20.99 60.87,20.99 60.31,21.55 50.22,21.55 48.98,20.31 28.4,20.31 25.03,16.94 19.36,16.94 18.85,16.43
  Top 1.27: SV31.3 18.85,16.29 18.85,16.43
VLED13
  Top 0.254: D13.A 141.33,25.39 140.32,26.41 135.88,26.41 135.31,25.84 122.89,25.84 121.94,26.79 117.17,26.79 116.68,26.29 104.78,26.29 103.85,27.22 98.73,27.22 98.18,26.67 86.48,26.67 85.5,27.65 79.83,27.65 79.26,27.08 68.3,27.08 67.37,28.01 61.55,28.01 61.01,27.46 50.16,27.46 49.18,28.44 27.09,28.44 22.24,33.28 21.81,33.28
  Top 1.27: SV31.18 21.81,33.28
VLED14
  Top 0.254: D14.A 141.27,23.19 140.32,22.24 135.88,22.24 135.31,22.81 122.92,22.81 121.94,21.83 117.11,21.83 116.56,22.38 104.8,22.38 103.85,21.42 97.5,21.42 96.93,22 86.5,22 85.5,20.99 79.27,20.99 78.69,21.56 68.31,21.56 67.33,20.59 60.7,20.59 60.14,21.15 50.39,21.15 49.15,19.9 29.24,19.9 24.93,15.59 21.8,15.59
  Top 1.27: SV31.4 21.7,15.5 21.8,15.59
VLED15
  Top 0.254: D15.A 159.61,25.4 158.63,26.38 154.2,26.38 153.62,25.8 141.49,25.8 140.48,26.81 135.72,26.81 135.15,26.24 123.06,26.24 122.11,27.19 117,27.19 116.51,26.7 104.95,26.7 104.02,27.62 98.56,27.62 98.02,27.08 86.65,27.08 85.67,28.06 79.66,28.06 79.09,27.48 68.47,27.48 67.54,28.41 61.38,28.41 60.84,27.87 50.33,27.87 49.35,28.84 27.99,28.84 22.17,34.66 19.53,34.66 19,35.19
  Top 1.27: SV31.19 18.38,35.82 19,35.19
VLED16
  Top 0.254: D16.A 159.58,23.16 158.63,22.21 154.2,22.21 153.62,22.78 141.44,22.78 140.48,21.83 135.72,21.83 135.14,22.4 123.09,22.4 122.11,21.42 116.94,21.42 116.39,21.97 104.97,21.97 104.02,21.02 97.34,21.02 96.76,21.59 86.67,21.59 85.67,20.59 79.1,20.59 78.52,21.16 68.48,21.16 67.5,20.18 60.53,20.18 59.97,20.74 50.56,20.74 49.31,19.5 30.29,19.5 25.22,14.43 19.47,14.43 18.9,13.86
  Top 1.27: SV31.1 18.9,13.8 18.9,13.86
VLED17
  Top 0.254: D17.A 178.21,25.37 177.2,26.38 172.76,26.38 172.19,25.81 159.78,25.81 158.8,26.79 154.03,26.79 153.45,26.21 141.66,26.21 140.65,27.22 135.55,27.22 134.98,26.65 123.23,26.65 122.28,27.6 116.84,27.6 116.34,27.1 105.11,27.1 104.18,28.03 98.39,28.03 97.85,27.48 86.81,27.48 85.84,28.46 79.49,28.46 78.92,27.89 68.63,27.89 67.71,28.82 61.21,28.82 60.67,28.27 50.5,28.27 49.52,29.25 28.47,29.25 21.9,35.82
  Top 0.305: D17.A 191.94,25.07
  Top 1.27: SV31.20 21.89,35.82 21.9,35.82
VLED18
  Top 0.254: D18.A 178.17,23.16 177.2,22.19 172.76,22.19 172.19,22.76 159.75,22.76 158.8,21.8 154.03,21.8 153.46,22.38 141.61,22.38 140.65,21.42 135.55,21.42 134.97,22 123.26,22 122.28,21.02 116.77,21.02 116.22,21.56 105.14,21.56 104.18,20.61 97.17,20.61 96.59,21.18 86.84,21.18 85.84,20.18 78.93,20.18 78.36,20.75 68.65,20.75 67.67,19.77 60.37,19.77 59.8,20.34 50.73,20.34 49.48,19.09 31.59,19.09 25.59,13.09 21.98,13.09
  Top 1.27: SV31.2 20.73,13.09 21.98,13.09

### Text on the board
tPlace: A8 | D17 | D18
bNames: JOSHUA BREWSTER (MIT LICENSE)
tValues: A1 | A2 | A3 | A4 | A5 | A6 | A7 | A9 | A10 | A11 | A12 | A13 | A14 | A8 | A15
tDocu: BASED ON pnas.org/content/104/29/12169 | 16 optical channels, 9 LED pairs / Forehead DIY-DOT | Use OPT101 (the cheap aliexpress ones) / and 1206 spec LEDs